# Altium schematic sheet power.SchDoc
size A; SheetNumber: 1; SheetTotal: 1
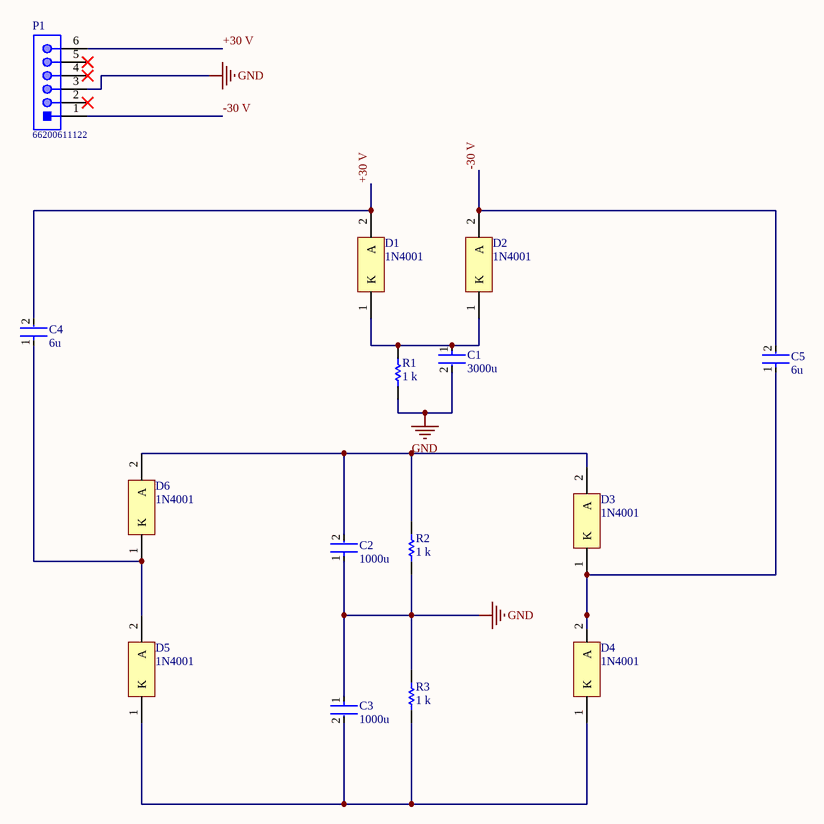
[diagram p0: power.SchDoc]

## Parts
C1  3000u  [FP-VY1472M63Y5UQ6TV0-MFG]
C2  1000u  [FP-VY1472M63Y5UQ6TV0-MFG]
C3  1000u  [FP-VY1472M63Y5UQ6TV0-MFG]
C4  6u  [FP-VY1472M63Y5UQ6TV0-MFG]
C5  6u  [FP-VY1472M63Y5UQ6TV0-MFG]
D1  1N4001  [ONSC-AXIAL_LEAD-2-59-10_P]
D2  1N4001  [ONSC-AXIAL_LEAD-2-59-10_P]
D3  1N4001  [ONSC-AXIAL_LEAD-2-59-10_P]
D4  1N4001  [ONSC-AXIAL_LEAD-2-59-10_P]
D5  1N4001  [ONSC-AXIAL_LEAD-2-59-10_P]
D6  1N4001  [ONSC-AXIAL_LEAD-2-59-10_P]
P1  66200611122  [66200611122]
R1  1 k  [OMTE-RES7X2.5-2]
R2  1 k  [OMTE-RES7X2.5-2]
R3  1 k  [OMTE-RES7X2.5-2]

## Nets
GND: C1.2 C2.1 C3.1 P1.3 R1.1 R2.1 R3.2
+30 V: C4.2 D1.2(A) P1.6
-30 V: C5.2 D2.2(A) P1.1
NetC1_1: C1.1 D1.1(K) D2.1(K) R1.2
NetC2_2: C2.2 D3.2(A) D6.2(A) R2.2
NetC3_2: C3.2 D4.1(K) D5.1(K) R3.1
NetC4_1: C4.1 D5.2(A) D6.1(K)
NetC5_1: C5.1 D3.1(K) D4.2(A)

Not connected (* = marked no-connect by the designer): P1 2* 4* 5*

## Library data of the parts
C1-C5 = CMP-02417-000050-1: CAP CER 4700PF 760VAC Y5U RADIAL; Voltage Rating (AC): 500V; Lead Diameter: 0.6mm; Capacitance: 4.7nF; Tolerance: 20%; Lead/Base Style: Kinked; Termination: Radial; Resistor Type: Ceramic; Radiation Hardening: No; Diameter: 16mm; Max Operating Temperature: 125°C; Case/Package: Radial; Thickness: 5mm; Lead Pitch: 10mm; Series: VY1; Contact Plating: Tin; Depth: 5mm; RoHS Compliant: Yes; Voltage: 500V; Voltage Rating (DC): 500V; Package Quantity: 500; Construction: RADIAL; Min Operating Temperature: -40°C; Height: 19mm; Height - Seated (Max): 0.787inch; Packaging: Tape and Reel; Dielectric: Y5U; Mount: Through Hole
D1-D6 = CMP-0902-00117-1: Standard Recovery Rectifier, 2-Pin Axial_Lead, Pb-Free, Bulk Bag; Manufacturer: On Semiconductor; VRRM Max (V): 50; IFSM Max (A): 30; IO(rec) Max (A): 1; ComponentLink3URL: http://www.onsemi.cn/pub_link/Collateral/59-10.PDF; ComponentLink3Description: Package Specification; PartNumber: 1N4001; PackageVersion: Rev. U, 02/2005; Packing: Bulk Bag; ComponentLink2Description: Datasheet; RoHS: TRUE; DatasheetVersion: Rev. 13; PackageReference: AXIAL_LEAD-2-59-10; ComponentLink1URL: http://www.onsemi.com/; Mounting Technology: Through Hole; PackageDescription: 2-Pin, Axial Lead, Diameter 2.35 mm; ComponentLink2URL: http://www.onsemi.com/pub_link/Collateral/1N4001-D.PDF; Type: Standard Recovery; ComponentLink1Description: Manufacturer URL
P1 = CMP-1502-00444-1: THT Male Header WR-MPC3, Vertical, Single Row, pitch 3 mm, 6 pins; Manufacturer: Wurth Elektronik; Working Voltage: 250VAC; Contact Resistance: 10mOhm; Pin Number: 6; Pitch: 3mm; Package Reference: 66200611122; Manufacturer URL: http://www.we-online.de; Packaging: Tube; Operating Temperature: -40to105degC; Publisher: WurthElektronik; Datasheet URL: https://katalog.we-online.de/em/datasheet/6620xx11122.pdf; Mounting Technology: THT; Gender: Male; Part Number: 66200611122; Orientation: Vertical
R1-R3 = CMP-2000-06865-1: Little Demon(R) Carbon Composition Molded OD Series, 250 V, 10 KOhm, +/-5%, -70 to 130 degC, 2-Pin THD, RoHS, Bulk; PartNumber: OD103JE; Manufacturer: Ohmite; Resistance (Ohms): 10k; Power Rating: 0.25W; Power (Watts): 0.25W,1/4W; Tolerance: ±5%; Online Catalog: OD,OF,OASeries,LittleDemon®; Catalog Drawings: OD,OF,OASeries; EDA / CAD Models: DownloadfromAcceleratedDesigns; Mounting Technology: ThroughHole; Datasheet Version: 06/2016; RoHS Information: LittleDemon"E"SeriesMaterialDeclaration; Number of Terminations: 2; Temperature Coefficient: -; Height: -; Composition: CarbonComposition; Package Description: 2-Pin THD Resistor, Body 7 x 2.5 mm, Lead Dia. 0.6 mm; Size / Dimension: 0.098"Diax0.276"L(2.50mmx7.00mm); Category: Resistors; Manufacturer URL: http://www.ohmite.com/; Features: PulseWithstanding; Family: ThroughHoleResistors; Supplier Device Package: Axial; Package / Case: Axial; Standard Package: 100; Package Reference: RES7X2.5; Operating Temperature: -; Series: LittleDemon®OD; Datasheet URL: http://www.ohmite.com/cat/res_od_of_oa.pdf; Packaging: Bulk